# EAGLE design LPC_4TE_3.50controller (EAGLE 5.04)
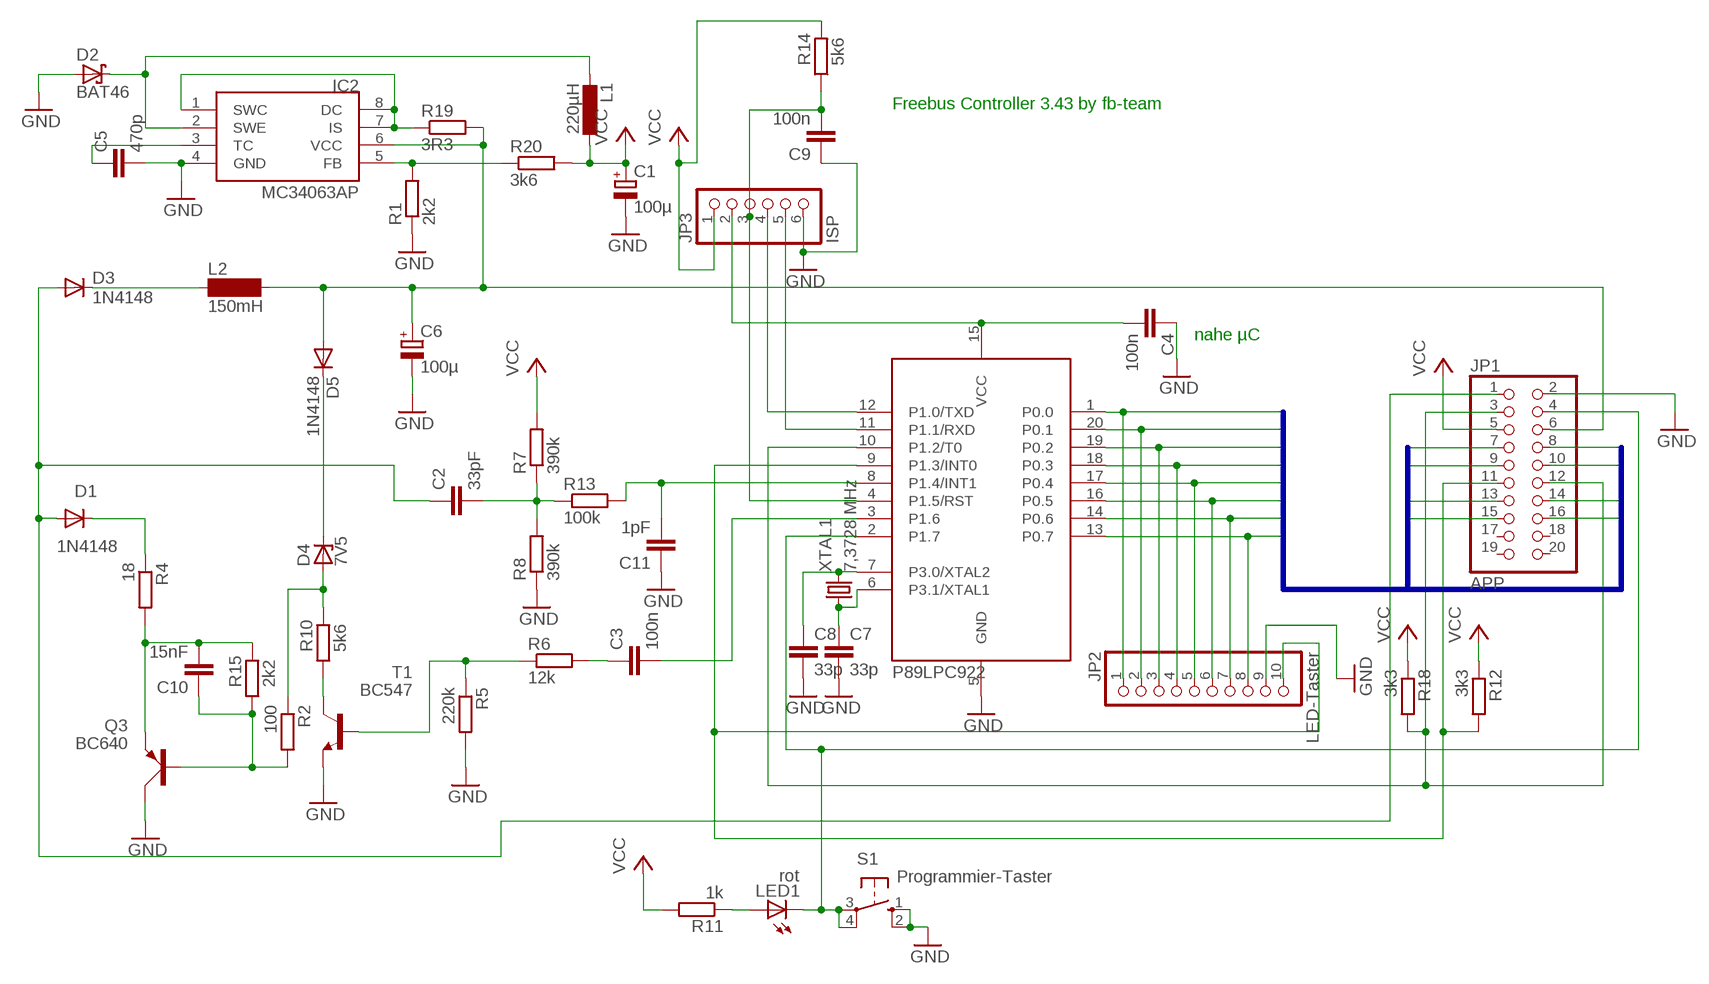
[diagram p0: schematic, sheet 1]

## Parts
C1  100µ  CPOL-EUE5-8.5  [E5-8,5]
C2  33pF  C-EU025-024X044  [C025-024X044]
C3  100n  C-EU050-024X044  [C050-024X044]
C4  100n  C-EU050-024X044  [C050-024X044]
C5  470p  C-EU025-024X044  [C025-024X044]
C6  100µ  CPOL-EUE5-8.5  [E5-8,5]
C7  33p  C-EUC1206  [C1206]
C8  33p  C-EUC1206  [C1206]
C9  100n  C-EU050-024X044  [C050-024X044]
C10  15nF  C-EU050-024X044  [C050-024X044]
C11  1pF  C-EU025-024X044  [C025-024X044]
D1  1N4148  [DO35-10]
D2  BAT46  BAT49  [DO41-10]
D3  1N4148  [DO35-10]
D4  7V5  ZPD  [DO35Z10]
D5  1N4148  [DO35-10]
IC1  89LPC922FN  89LPC922  [DIL20]
IC2  MC34063AP  [DIL08]
JP1  APP  PINHD-2X10  [2X10]
JP2  LED-Taster  PINHD-1X10  [1X10]
JP3  ISP  PINHD-1X6  [1X06]
L1  220µH  L-EU2200-12.7  [2200-12.7]
L2  150mH  SD12-1000  [SD12_1000]
LED1  rot  LED3MM  [LED3MM]
Q3  BC640  [SOT54D]
R1  2k2  R-EU_0207/10  [0207/10]
R2  100  R-EU_0207/10  [0207/10]
R4  18  R-EU_0207/10  [0207/10]
R5  220k  R-EU_0207/10  [0207/10]
R6  12k  R-EU_0207/10  [0207/10]
R7  390k  R-EU_0207/10  [0207/10]
R8  390k  R-EU_0207/10  [0207/10]
R10  5k6  R-EU_0207/10  [0207/10]
R11  1k  R-EU_0207/10  [0207/10]
R12  3k3  R-EU_0207/10  [0207/10]
R13  100k  R-EU_0207/10  [0207/10]
R14  5k6  R-EU_0207/10  [0207/10]
R15  2k2  R-EU_0207/10  [0207/10]
R18  3k3  R-EU_0207/10  [0207/10]
R19  3R3  R-EU_0207/10  [0207/10]
R20  3k6  R-EU_0207/10  [0207/10]
S1  Programmier-Taster  10-XX  [B3F-10XX]
T1  BC547  [TO92]
XTAL1  7,3728 MHz  CRYSTALHC49S  [HC49/S]

## Nets
/RESTET: C9.2 IC1.4(P1.5/RST) JP3.3 R14.1
DRAIN: C10.2 Q3.E R4.2 R15.2
EIB_DC: C6.+ D5.A IC2.6(VCC) JP1.6 L2.2 R19.2
EIBIN: C11.2 IC1.8(P1.4/INT1) R13.2
GND: C1.- C4.1 C5.2 C6.- C7.2 C8.2 C9.1 C11.1 D2.A IC1.5(GND) IC2.4(GND) JP1.2 JP2.9 JP3.6 Q3.C R1.1 R5.2 R8.1 S1.1(S) S1.2(S1) T1.1(E)
INT0_TASTER: IC1.9(P1.3/INT0) JP1.11 JP2.10 R12.2
N$1: C3.1 R6.2
N$2: C2.2 R7.1 R8.2 R13.1
N$3: IC2.5(FB) R1.2 R20.1
N$4: IC2.1(SWC) IC2.7(IS) IC2.8(DC) R19.1
N$5: C3.2 IC1.3(P1.6)
N$6: R10.1 T1.3(C)
N$8: D3.C L2.1
N$9: D1.C R4.1
N$10: D2.C IC2.2(SWE) L1.2
N$11: D4.A R2.1 R10.2
N$12: R5.1 R6.1 T1.2(B)
N$13: C5.1 IC2.3(TC)
N$15: C10.1 Q3.B R2.2 R15.1
N$16: C2.1 D1.A D3.A JP1.1
N$20: C8.1 IC1.7(P3.0/XTAL2) XTAL1.2
N$21: C7.1 IC1.6(P3.1/XTAL1) XTAL1.1
N$29: IC1.12(P1.0/TXD) JP3.4
N$30: IC1.11(P1.1/RXD) JP3.5
N$40: D4.C D5.C
N$41: LED1.A R11.1
P0.0: IC1.1(P0.0) JP1.7 JP2.1
P0.1: IC1.20(P0.1) JP1.8 JP2.2
P0.2: IC1.19(P0.2) JP1.9 JP2.3
P0.3: IC1.18(P0.3) JP1.10 JP2.4
P0.4: IC1.17(P0.4) JP1.13 JP2.5
P0.5: IC1.16(P0.5) JP1.14 JP2.6
P0.6: IC1.14(P0.6) JP1.15 JP2.7
P0.7: IC1.13(P0.7) JP1.16 JP2.8
PROG: IC1.2(P1.7) JP1.4 LED1.K(C) S1.3(P) S1.4(P1)
PWM: IC1.10(P1.2/T0) JP1.3 JP1.12 R18.2
VCC: C1.+ JP1.5 JP3.1 L1.1 R7.2 R11.2 R12.1 R14.2 R18.1 R20.2
VCC_LPC: C4.2 IC1.15(VCC) JP3.2
Unconnected: JP1.17 JP1.18 JP1.19 JP1.20

## Buses
P0.[0..7]

## Notes on the sheet
- Freebus Controller 3.43 by fb-team
- nahe µC
- P89LPC922

## Library data of the parts
C1 C6 = rcl:CPOL-EU: POLARIZED CAPACITOR, European symbol
C2-C5 C7-C11 = rcl:C-EU: CAPACITOR, European symbol
D1 D3 D5 = diode:1N4148: DIODE high speed (Philips)
D2 = diode:BAT49: DIODE small signal diode
D4 = diode:ZPD: Z DIODE 500 mW
IC1 = micro-philips:89LPC922
IC2 = mc34063:MC34063
JP1 = pinhead:PINHD-2X10: PIN HEADER
JP2 = pinhead:PINHD-1X10: PIN HEADER
JP3 = pinhead:PINHD-1X6: PIN HEADER
L1 = rcl:L-EU: INDUCTOR, European symbol
L2 = inductor-neosid:SD12: INDUCTOR nominal inductance
LED1 = led:LED: LED OSRAM: - CHIPLED LG R971, LG N971, LY N971, LG Q971, LY Q971, LO R971, LY R971 LH N974, LH R974 LS Q976, LO Q976, LY Q976 LO Q996 - Hyper CHIPLED LW Q18S LB Q993, LB Q99A, LB R99A - SideLED LS A670, LO A670, LY A670, LG A670, LP A670 LB A673, LV A673, LT A673, LW A673 LH A674 LY A675 LS A676, LA A676, LO A676, LY A676, LW A676 LS A679, LY A679, LG A679 - Hyper Micro SIDELED® LS Y876, LA Y876, LO Y876, LY Y876 LT Y87S - SmartLED LW L88C, LW L88S LB L89C, LB L89S, LG L890 LS L89K, LO L89K, LY L89K LS L896, LA L896, LO L896, LY L896 - TOPLED LS T670, LO T670, LY T670, LG T670, LP T670 LSG T670, LSP T670, LSY T670, LOP T670, LYG T670 LG T671, LOG T671, LSG T671 LB T673, LV T673, LT T673, LW T673 LH T674 LS T676, LA T676, LO T676, LY T676, LB T676, LH T676, LSB T676, LW T676 LB T67C, LV T67C, LT T67C, LS T67K, LO T67K, LY T67K, LW E67C LS E67B, LA E67B, LO E67B, LY E67B, LB E67C, LV E67C, LT E67C LW T67C LS T679, LY T679, LG T679 LS T770, LO T770, LY T770, LG T770, LP T770 LB T773, LV T773, LT T773, LW T773 LH T774 LS E675, LA E675, LY E675, LS T675 LS T776, LA T776, LO T776, LY T776, LB T776 LHGB T686 LT T68C, LB T68C - Hyper Mini TOPLED® LB M676 - Mini TOPLED Santana® LG M470 LS M47K, LO M47K, LY M47K Source: http://www.osram.convergy.de - LUMILED® LXK2-PW12-R00, LXK2-PW12-S00, LXK2-PW14-U00, LXK2-PW14-V00 LXK2-PM12-R00, LXK2-PM12-S00, LXK2-PM14-U00 LXK2-PE12-Q00, LXK2-PE12-R00, LXK2-PE12-S00, LXK2-PE14-T00, LXK2-PE14-U00 LXK2-PB12-K00, LXK2-PB12-L00, LXK2-PB12-M00, LXK2-PB14-N00, LXK2-PB14-P00, LXK2-PB14-Q00 LXK2-PR12-L00, LXK2-PR12-M00, LXK2-PR14-Q00, LXK2-PR14-R00 LXK2-PD12-Q00, LXK2-PD12-R00, LXK2-PD12-S00 LXK2-PH12-R00, LXK2-PH12-S00 LXK2-PL12-P00, LXK2-PL12-Q00, LXK2-PL12-R00 Source: www.luxeon.com
Q3 = transistor-small-signal:BC640: PNP TRANSISTOR
R1 R2 R4-R8 R10-R15 R18-R20 = rcl:R-EU_: RESISTOR, European symbol
S1 = switch-omron:10-XX: OMRON SWITCH
T1 = transistor:BC547: NPN TRANSISTOR
XTAL1 = crystal:CRYSTAL: CRYSTAL

## Board
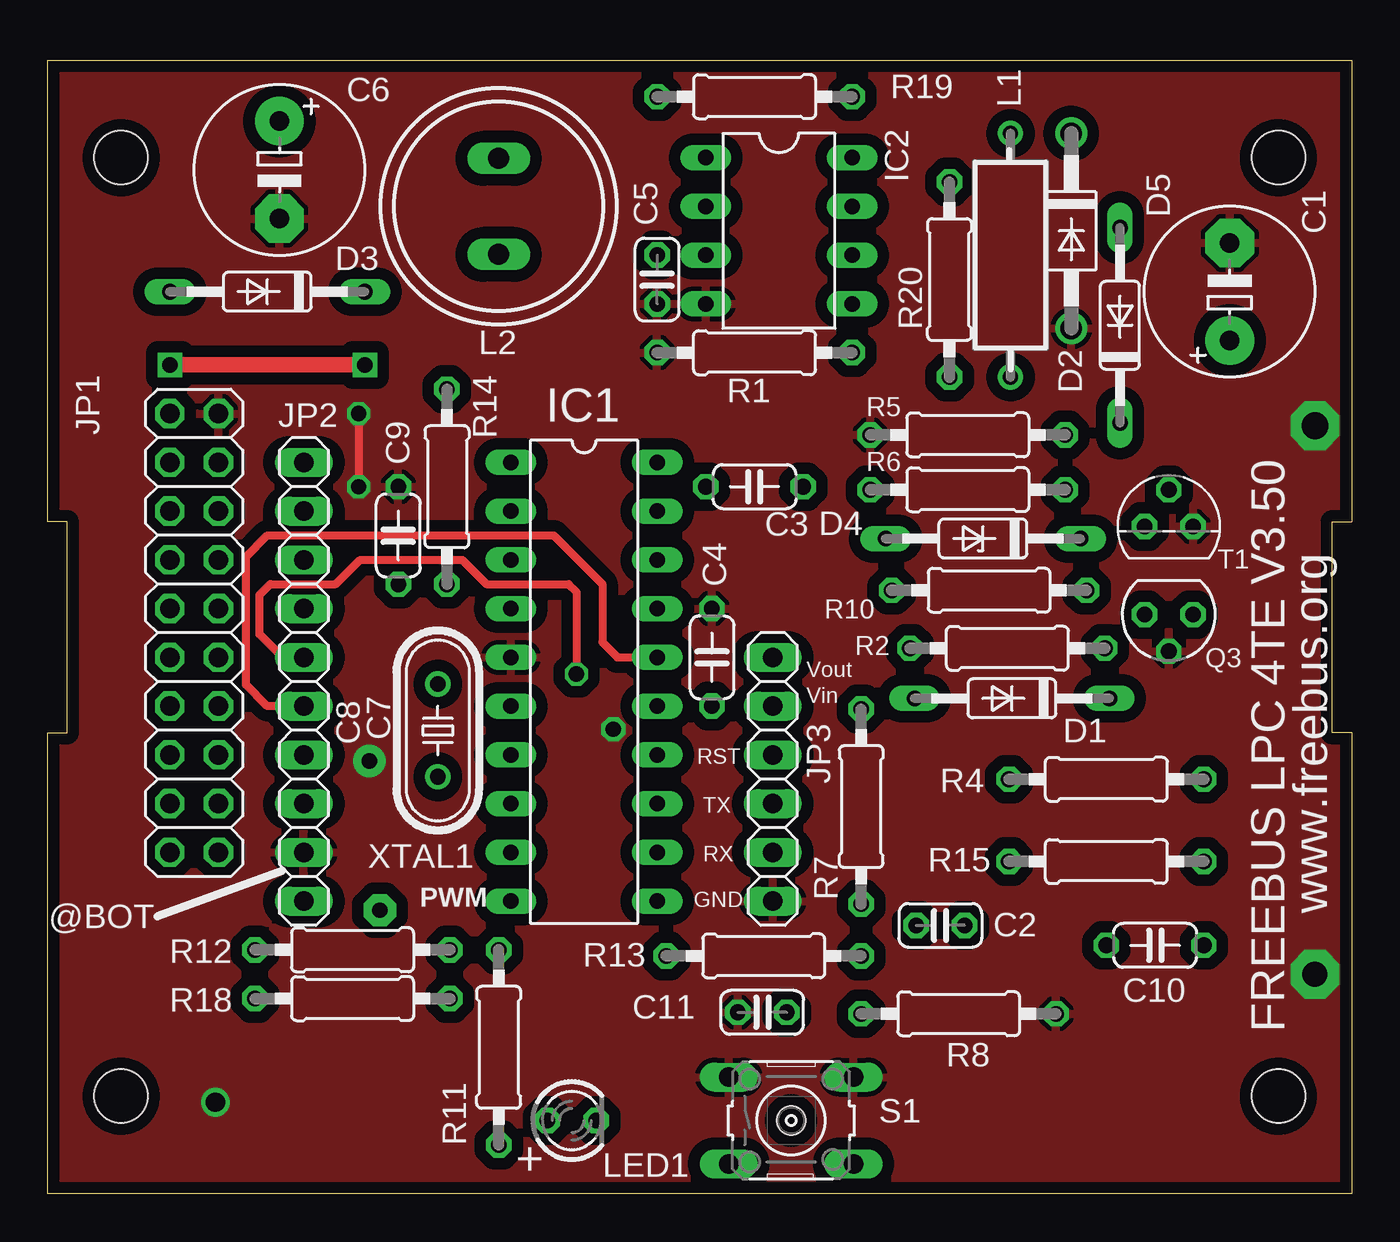
[diagram p1: board, top side]
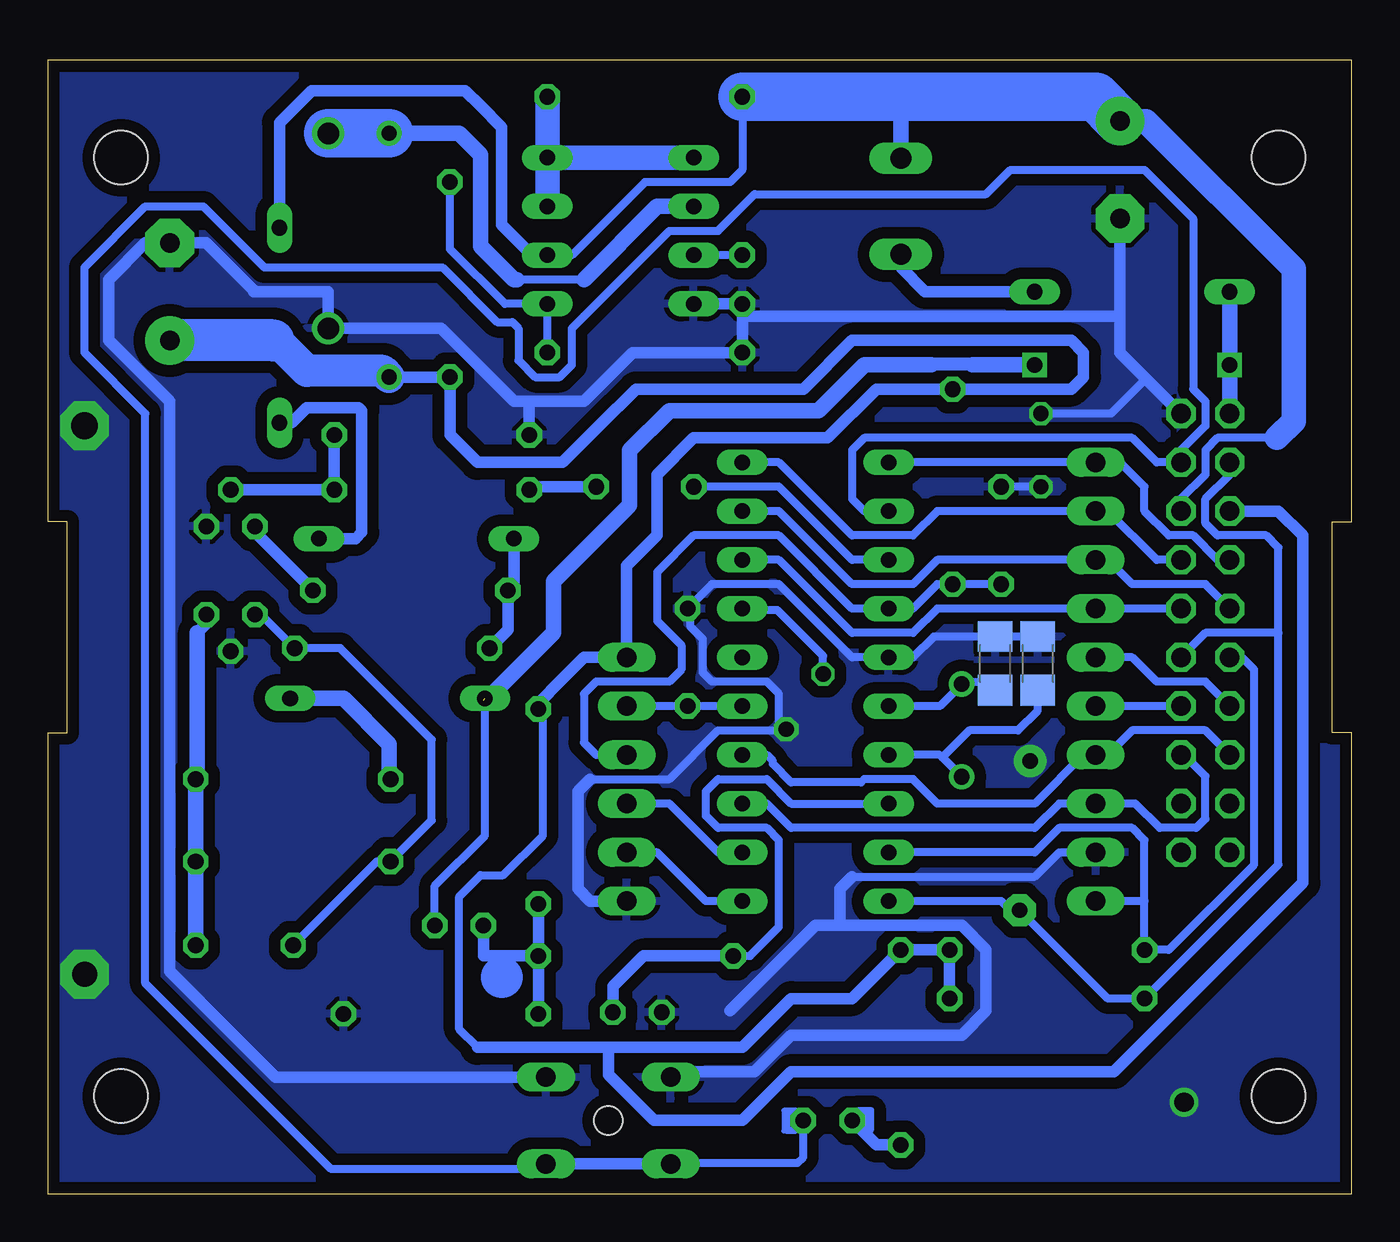
[diagram p2: board, bottom side, seen from below]

Size 67.94 x 59.05 mm. Coordinates in mm from the lower left corner, seen from the top.
Outline: 0,0 0,24 1,24 1,35 0,35 0,59.05 67.94,59.05 67.94,35 66.94,35 66.94,24 67.94,24 67.94,0 0,0
Copper layers (1*16): Top 0.035mm / dielectric 1.5mm / Bottom 0.035mm
Design rules "default *": minimum track width 10mil, minimum drill 24mil, track to track 12mil, track to pad 12mil, pad to pad 12mil, via to via 12mil, smd to smd 8mil, copper to edge 20mil, drill to drill 8mil, minimum pad ring 10mil, minimum via ring 8mil, stop-mask expansion 4mil, vias tented up to drill 0mil, thermal gap 10mil
Holes 2.8 mm at 3.81,53.98 64.14,53.98 64.14,5.08 3.81,5.08
Holes 1.5 mm at 38.73,3.81

### Footprints (pad centres in the part's own frame; a part is rotated, then mirrored left to right if it is on the bottom)
E5-8,5 = drill 1.016 pad 2.54 round: + -2.54,0 | drill 1.016 pad 2.54 octagon: - 2.54,0
C025-024X044 = drill 0.813 octagon: 1 -1.27,0; 2 1.27,0
C050-024X044 = drill 0.813 octagon: 1 -2.54,0; 2 2.54,0
C1206 = smd 1.6 x 1.8: 1 -1.4,0; 2 1.4,0
DO35-10 = drill 0.813 long: A 5.08,0; C -5.08,0
DO41-10 = drill 1.118 round: A 5.08,0; C -5.08,0
DO35Z10 = drill 0.813 long: A 5.08,0; C -5.08,0
DIL20 = drill 0.813 long: 1 -11.43,-3.81; 2 -8.89,-3.81; 3 -6.35,-3.81; 4 -3.81,-3.81; 5 -1.27,-3.81; 6 1.27,-3.81; 7 3.81,-3.81; 8 6.35,-3.81; 9 8.89,-3.81; 10 11.43,-3.81; 11 11.43,3.81; 12 8.89,3.81; 13 6.35,3.81; 14 3.81,3.81; 15 1.27,3.81; 16 -1.27,3.81; 17 -3.81,3.81; 18 -6.35,3.81; 19 -8.89,3.81; 20 -11.43,3.81
DIL08 = drill 0.813 long: 1 -3.81,-3.81; 2 -1.27,-3.81; 3 1.27,-3.81; 4 3.81,-3.81; 5 3.81,3.81; 6 1.27,3.81; 7 -1.27,3.81; 8 -3.81,3.81
2X10 = drill 1.016 octagon: 1 -11.43,-1.27; 2 -11.43,1.27; 3 -8.89,-1.27; 4 -8.89,1.27; 5 -6.35,-1.27; 6 -6.35,1.27; 7 -3.81,-1.27; 8 -3.81,1.27; 9 -1.27,-1.27; 10 -1.27,1.27; 11 1.27,-1.27; 12 1.27,1.27; 13 3.81,-1.27; 14 3.81,1.27; 15 6.35,-1.27; 16 6.35,1.27; 17 8.89,-1.27; 18 8.89,1.27; 19 11.43,-1.27; 20 11.43,1.27
1X10 = drill 1.016 long: 1 -11.43,0; 2 -8.89,0; 3 -6.35,0; 4 -3.81,0; 5 -1.27,0; 6 1.27,0; 7 3.81,0; 8 6.35,0; 9 8.89,0; 10 11.43,0
1X06 = drill 1.016 long: 1 -6.35,0; 2 -3.81,0; 3 -1.27,0; 4 1.27,0; 5 3.81,0; 6 6.35,0
2200-12.7 = drill 0.8 pad 1.27 round: 1 -6.35,0; 2 6.35,0
SD12_1000 = drill 1.1 long: 1 -2.5,0; 2 2.5,0
LED3MM = drill 0.813 octagon: A -1.27,0; K 1.27,0
SOT54D = drill 0.813 octagon: B 1.27,0; C 0,1.905; E -1.27,0
0207/10 = drill 0.813 octagon: 1 -5.08,0; 2 5.08,0
B3F-10XX = drill 1.016 long: 1 -3.251,2.261; 2 3.251,2.261; 3 -3.251,-2.261; 4 3.251,-2.261
TO92 = drill 0.813 octagon: 1 1.27,0; 2 0,1.905; 3 -1.27,0
HC49/S = drill 0.813 round: 1 -2.413,0; 2 2.413,0

### Placement (x,y rotation side)
C1  61.59,46.99 90 top
C2  46.51,13.97 180 top
C3  36.83,36.83 180 top
C4  34.61,27.94 270 top
C5  31.75,47.62 270 top
C6  12.06,53.34 270 top
C7  18.57,27.62 90 bottom
C8  16.35,27.62 90 bottom
C9  18.26,34.29 270 top
C10  57.71,12.94 0 top
C11  37.23,9.45 0 top
D1  50.24,25.8 180 top
D2  53.34,50.16 270 top
D3  11.43,46.99 180 top
D4  48.74,34.13 180 top
D5  55.88,45.24 90 top
IC1  27.94,26.67 270 top
IC2  38.1,50.16 270 top
JP1  7.62,29.21 270 top
JP2  13.34,26.67 270 top
JP3  37.78,21.59 270 top
L1  50.16,48.9 90 top
L2  23.5,51.44 90 top
LED1  27.3,3.81 0 top
Q3  58.42,30.16 180 top
R1  36.83,43.81 0 top
R2  50.01,28.42 0 top
R4  55.17,21.59 0 top
R5  47.94,39.53 180 top
R6  47.94,36.67 180 top
R7  42.39,20.16 90 top
R8  47.47,9.37 180 top
R10  49.05,31.43 180 top
R11  23.5,7.62 90 top
R12  15.88,12.7 180 top
R13  37.31,12.38 180 top
R14  20.8,36.83 90 top
R15  55.17,17.3 0 top
R18  15.88,10.16 180 top
R19  36.83,57.15 180 top
R20  46.99,47.62 270 top
S1  38.73,3.81 0 top
T1  58.42,34.77 0 top
XTAL1  20.32,24.13 270 top

### Tracks (layer width: path | path; a pad name or v marks a point on that pad's centre or on a via)
/RESTET
  Bottom 0.406: JP3.3 39.37,22.86 40.01,23.5 40.01,26.04 39.37,26.67 35.56,26.67 34.92,27.3 34.92,28.57 36.2,29.84 36.2,32.38 34.29,34.29 29.84,34.29 26.04,30.48 IC1.4 22.86,30.48 21.59,31.75 R14.1 | C9.2 R14.1 | R14.1
DRAIN
  Bottom 0.61: Q3.E 59.69,29.69 60.17,29.21
  Bottom 0.813: 60.17,29.21 60.17,21.67 R4.2 R15.2 C10.2
EIB_DC
  Bottom 0.406: JP1.6 8.89,36.2 7.62,37.47 7.62,38.73 6.99,39.37 3.89,39.37 | IC2.6 40.64,48.9 36.83,52.7 32.38,52.7 31.75,53.34 R19.2
  Bottom 0.61: L2.2 23.5,53.98 | IC2.6 42.7,48.9 44.29,50.48 44.29,55.56 45.4,56.67 | 45.4,56.67 | 45.4,56.67 46.2,57.47 54.21,57.47 55.88,55.8 D5.A
  Bottom 0.813: 23.5,57.15 L2.2
  Bottom 1.27: C6.+ 10.72,55.88 3.02,48.18 3.02,40.24 3.89,39.37
  Bottom 2.54: C6.+ 13.34,57.15 23.5,57.15 R19.2
EIBIN
  Bottom 0.406: IC1.8 29.21,20.32 30.48,21.59 33.02,21.59 33.66,20.95 33.66,19.68 33.02,19.05 30.48,19.05 29.84,18.41 29.84,13.89 31.35,12.38 R13.2
  Bottom 0.61: C11.2 38.5,10.79 36.91,12.38 R13.2
GND  (via drill 0.8, 0.8 pad 1.27, 0.8 pad 1.68, 1, 1.3 pad 2.54, 1.4 pad 2.54)
  Top 0.406: v16.19,40.64 v16.19,36.83
  Bottom 0.406: 39.69,21.59 35.56,21.59 33.02,24.13 29.84,24.13 29.84,26.04 30.48,26.67 33.34,26.67 33.81,27.15 33.81,28.89 34.45,29.53 34.45,30.32 | JP2.9 15.24,17.78 16.51,16.51 26.04,16.51 | C9.1 v16.19,36.83 | v16.19,40.64 12.54,40.64 10.72,42.47 | C4.1 33.34,31.75 29.84,31.75 26.04,27.94 IC1.5 22.86,27.94 21.78,29.02 C8.2
  Bottom 0.61: JP3.6 39.69,15.24 40.32,15.88 40.32,20.95 39.69,21.59 | S1.1 35.48,6.27 35.56,6.35 31.11,6.35 29.21,8.26 20.32,8.26 19.05,9.53 19.05,12.7 20.32,13.97 26.67,13.97 | 32.38,9.53 27.94,13.97 26.67,13.97 | 26.04,16.51 26.67,15.88 26.67,13.97 | JP1.2 10.72,42.47 12.06,43.81 12.06,45.72 | 12.06,45.72 C6.- | IC2.4 C5.2 31.75,45.72 | 31.75,45.72 12.06,45.72 | 31.75,45.72 R1.1 37.47,43.81 40.01,41.27 43.02,41.27 | 43.02,41.27 43.66,41.27 47.47,45.09 D2.A 53.34,46.99 57.23,46.99 57.23,47.07 59.69,49.53 C1.- 62.87,49.53 64.77,47.62 64.77,44.45 61.59,41.27 61.59,21.51 | 61.59,21.51 61.59,21.43 | R5.2 42.86,41.12 43.02,41.27 | S1.2 56.08,6.07 61.12,11.11 61.59,11.59 61.59,21.51
  other vias: 66.04,11.43 66.04,40.01 16.75,22.54 29.47,24.19 8.73,4.76
  pour Bottom (isolate 0.61): -0.16,0 0,59.05 67.94,59.05 67.94,0
  pour Top (isolate 0.61): -0.16,59.37 -0.16,-0.32 68.26,-0.32 68.26,59.21 0.32,59.21
INT0_TASTER
  Bottom 0.406: IC1.9 16.51,17.78 15.24,19.05 11.43,19.05 10.79,18.41 10.79,15.24 | JP1.11 5.71,27.94 5.08,27.3 5.08,17.14 9.53,12.7 R12.2 10.79,15.24 | 10.79,15.24 JP2.10
N$1
  Bottom 0.61: C3.1 42.7,36.83 R6.2
N$2
  Bottom 0.406: R13.1 42.39,12.7 | R13.1
  Bottom 0.61: 42.39,12.7 R7.1 | 45.24,12.38 R13.1 R8.2 | R8.2 | 45.24,12.38 C2.2 | 45.24,12.38
N$3
  Bottom 0.406: R1.2 IC2.5 44.13,46.35 46.99,49.21 R20.1
N$4
  Bottom 1.27: IC2.1 IC2.8 | IC2.8 IC2.7 | IC2.8 R19.1
N$5
  Bottom 0.406: IC1.3 26.04,33.02 29.84,36.83 C3.2
N$6
  Bottom 0.61: T1.3 57.15,34.45 R10.1
N$8
  Bottom 0.61: D3.C 22.23,46.99 23.5,48.26 L2.1
N$9
  Bottom 0.813: D1.C 52.55,25.8 50.16,23.42 50.16,21.67 R4.1
N$10
  Bottom 0.406: 40.01,47.62 43.5,47.62
  Bottom 0.813: 43.5,47.62 43.66,47.62 45.4,49.37 45.4,54.13 46.51,55.24 L1.2 | IC2.2 36.2,51.44 40.01,47.62
  Bottom 2.54: L1.2 D2.C
N$11
  Bottom 0.61: D4.A 43.66,31.59 43.81,31.59 R10.2 43.97,29.37 R2.1
N$12
  Bottom 0.61: R5.1 R6.1 T1.2 | T1.2
N$13
  Bottom 0.406: C5.1 IC2.3
N$15
  Bottom 0.406: 56.83,30.16 R2.2 52.7,28.42 47.94,23.65 47.94,19.45 R15.1 50.8,17.3 C10.1
  Bottom 0.61: 56.83,30.16 Q3.B
N$16  (via drill 0.8 pad 1.27)  (1 unrouted)
  Top 0.813: v6.35,43.18 v16.51,43.18
  Bottom 0.305: 19.68,43.42 21.91,43.42 21.91,43.18
  Bottom 0.406: D1.A 45.16,18.65 47.78,16.03 C2.1 | C2.1
  Bottom 0.61: 19.76,43.18 21.91,43.18
  Bottom 0.813: D3.A v6.35,43.18 JP1.1 | 45.24,25.72 45.56,26.04 44.77,26.04 41.59,29.21 41.59,31.91 37.62,35.88 37.62,38.73 35.56,40.8 27.78,40.8 25.4,43.18 21.91,43.18 | v16.51,43.18 19.76,43.18
N$20
  Bottom 0.406: IC1.7 21.46,22.86 21.33,22.73 | 21.33,22.73 XTAL1.2 | C8.1 16.35,25.16 17.38,24.13 19.92,24.13 21.33,22.73
N$21
  Bottom 0.406: IC1.6 21.46,25.4 XTAL1.1 20.29,26.51 arc90 20.13,26.67 18.89,26.67 arc90 18.57,26.35 C7.1
N$29
  Bottom 0.406: IC1.12 33.02,17.78 35.56,20.32 JP3.4
N$30
  Bottom 0.406: IC1.11 33.66,15.24 36.2,17.78 JP3.5
N$40
  Bottom 0.61: D5.C 55.24,40.16 54.45,40.96 51.75,40.96 51.59,40.8 51.59,34.45 51.91,34.13 D4.C | D4.C
N$41
  Bottom 0.254: 25.66,4.32 25.68,4.32 25.72,4.36 25.02,4.36 25,4.34 25,3.33 25.06,3.27 25.71,3.27 25.72,3.28 25.72,3.3 | 25.72,3.3 25.48,3.54 25.48,4.13 25.45,4.16 25.23,4.16 25.22,4.17 25.22,3.47 25.34,3.47 25.36,3.48 25.36,4.06 25.36,4.07 | 25.72,3.3 25.72,3.31 25.63,3.4
  Bottom 0.61: R11.1 24.77,2.54 25.63,3.4 LED1.A
P0.0
  Bottom 0.406: JP1.7 6.99,33.02 8.26,34.29 9.53,34.29 10.79,35.56 10.79,36.83 12.06,38.1 JP2.1 IC1.1
P0.1
  Bottom 0.406: IC1.20 29.84,38.1 26.04,34.29 22.86,34.29 21.59,35.56 JP2.2 12.7,35.56 10.16,33.02 JP1.8
P0.2
  Bottom 0.406: JP1.9 7.62,31.75 11.43,31.75 12.7,33.02 JP2.3 21.59,33.02 22.86,31.75 26.04,31.75 29.84,35.56 IC1.19
P0.3
  Bottom 0.406: IC1.18 29.84,33.02 26.04,29.21 22.86,29.21 21.59,30.48 JP2.4 JP1.10
P0.4  (via drill 0.8)
  Top 0.406: JP2.5 12.22,27.94 11.03,29.13 11.03,31.19 11.59,31.75 15,31.75 16.27,33.02 21.59,33.02 22.86,31.75 27.15,31.75 27.54,31.35 v27.54,27.07
  Bottom 0.406: JP1.13 7.62,26.67 10.16,26.67 11.43,27.94 JP2.5 | v27.54,27.07 27.54,28.02 29.92,30.4 31.67,30.4 IC1.17
P0.5
  Top 0.406: JP2.6 11.43,25.4 10.32,26.51 10.32,33.18 11.43,34.29 26.35,34.29 28.89,31.75 28.89,28.73 29.69,27.94 IC1.16
  Bottom 0.406: JP1.14 JP2.6
P0.6
  Bottom 0.406: JP1.15 7.62,24.13 11.43,24.13 12.7,22.86 JP2.7 13.97,22.86 16.51,20.32 21.59,20.32 22.86,21.59 25.4,21.59 25.56,21.43 29.21,21.43 | IC1.14 30.48,22.86 30.16,22.54 30.16,22.38 29.21,21.43 | 29.21,21.43
P0.7
  Bottom 0.406: IC1.13 30.48,20.32 29.21,19.05 16.51,19.05 15.24,20.32 JP2.8 11.27,20.32 10,19.05 8.1,19.05 7.62,19.53 7.62,21.75 8.73,22.86 JP1.16
PROG
  Bottom 0.254: 29.21,4.24 29.37,4.24 29.37,3.44 29.02,3.25 28.96,3.25 28.96,3.26 29.44,3.26 29.59,3.27 29.59,4.34 28.94,4.34 28.94,4.17 LED1.K
  Bottom 0.406: IC1.2 25.4,35.56 26.04,36.2 26.04,38.73 25.4,39.37 11.43,39.37 10.16,38.1 JP1.4 8.89,38.73 7.62,40.01 7.62,41.27 8.26,41.91 8.26,50.8 10.79,53.34 17.78,53.34 19.05,52.07 31.11,52.07 33.02,50.16 35.56,50.16 40.01,45.72 | S1.4 41.99,1.35 41.91,1.27 53.18,1.27 62.87,10.95 62.87,40.64 66.04,43.81 66.04,48.26 62.87,51.44 59.85,51.44 56.67,48.26 47.39,48.26 44.53,45.4 43.74,45.4 43.42,45.09 43.42,43.42 42.55,42.55 41.27,42.55 40.64,43.18 40.64,45.09 40.01,45.72 | LED1.K 28.57,1.91 28.89,1.59 35.45,1.59 S1.3 | 40.01,45.72
  Bottom 0.61: 35.56,1.55 S1.3 34.57,1.55 | 35.56,1.55 S1.4 | 35.56,1.55 35.56,1.27
PWM  (via drill 0.8 pad 1.68)
  Bottom 0.406: v17.3,14.76 17.78,15.24 | v17.3,14.76 17.78,14.76 18.26,15.24 IC1.10 | 3.81,29.21 3.81,17.14 R18.2 12.7,10.16 v17.3,14.76 | 3.81,29.21 7.62,29.21 JP1.12 | JP1.3 6.35,37.47 7.62,36.2 7.62,34.92 6.99,34.29 4.45,34.29 3.81,33.66 3.81,29.21
VCC
  Bottom 0.406: 45.56,7.62 46.51,8.57 46.51,15.48 45.4,16.59 44.21,16.59 42.15,18.65 42.15,25.16 42.07,25.24 R7.2 | 42.31,25.64 42.31,25.32 R7.2 | R7.2
  Bottom 0.61: R18.1 R12.1 R11.2 26.04,10.16 29.21,10.16 31.75,7.62 38.73,7.62 | 41.27,26.67 40.01,27.94 JP3.1 37.78,32.7 36.2,34.29 36.2,37.47 34.29,39.37 27.3,39.37 24.77,41.91 R14.2 14.61,41.91 13.97,42.55 13.97,43.81 14.61,44.45 26.04,44.45 28.57,41.91 37.31,41.91 39.21,40.01 39.37,39.85 41.12,38.1 45.56,38.1 46.99,39.53 R20.2 L1.1 | 38.73,7.62 45.56,7.62 | JP1.5 3.81,35.56 2.54,34.29 2.54,16.19 12.38,6.35 29.21,6.35 31.75,3.81 | 31.75,3.81 | 31.75,3.81 36.35,3.81 38.73,6.19 38.73,7.62 | 41.27,26.67 | 41.27,26.67 | 42.31,25.64 41.27,26.67
  Bottom 1.676: 56.2,44.45 56.04,44.45 54.45,42.86 50.48,42.86 L1.1
  Bottom 2.184: 56.2,44.45 C1.+
VCC_LPC
  Bottom 0.406: IC1.15 C4.2 JP3.2 | JP3.2
(copper drawn outside any net)
  shapes: Bottom circle x1

### Text on the board
tPlace: Vout | Vin | RST | TX | RX | @BOT | PWM | GND | +
tNames: www.freebus.org | FREEBUS LPC 4TE V3.50
tValues: auf Lötseite: